# Altium schematic sheet p1_led_adapter.SchDoc
size A
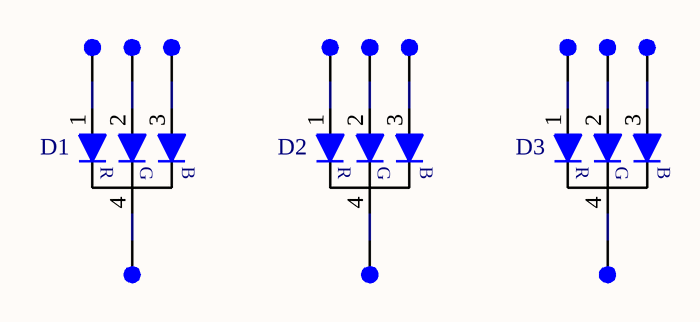
[diagram p0: p1_led_adapter.SchDoc]

## Parts
D1  XZM2CRKM2DGFBB45SCCB  [SUN_PLCC4]  (value not drawn)
D2  XZM2CRKM2DGFBB45SCCB  [SUN_PLCC4]  (value not drawn)
D3  XZM2CRKM2DGFBB45SCCB  [SUN_PLCC4]  (value not drawn)
TP1  PTH Test Point  [TP_PTH]  (value not drawn)
TP2  PTH Test Point  [TP_PTH]  (value not drawn)
TP3  PTH Test Point  [TP_PTH]  (value not drawn)
TP4  PTH Test Point  [TP_PTH]  (value not drawn)
TP5  PTH Test Point  [TP_PTH]  (value not drawn)
TP6  PTH Test Point  [TP_PTH]  (value not drawn)
TP7  PTH Test Point  [TP_PTH]  (value not drawn)
TP8  PTH Test Point  [TP_PTH]  (value not drawn)
TP9  PTH Test Point  [TP_PTH]  (value not drawn)
TP10  PTH Test Point  [TP_PTH]  (value not drawn)
TP11  PTH Test Point  [TP_PTH]  (value not drawn)
TP12  PTH Test Point  [TP_PTH]  (value not drawn)

## Nets
NetD1_1: D1.1(A1) TP1.1
NetD1_2: D1.2(A2) TP2.1
NetD1_3: D1.3(A3) TP3.1
NetD1_4: D1.4(K) TP10.1
NetD2_1: D2.1(A1) TP4.1
NetD2_2: D2.2(A2) TP5.1
NetD2_3: D2.3(A3) TP6.1
NetD2_4: D2.4(K) TP11.1
NetD3_1: D3.1(A1) TP7.1
NetD3_2: D3.2(A2) TP8.1
NetD3_3: D3.3(A3) TP9.1
NetD3_4: D3.4(K) TP12.1

## Notes on the sheet
- (in symbol RGB LED) R; G; B

## Library data of the parts
D1-D3 = RGB LED: LED RGB CLEAR 4PLCC SMD; Manufacturer: SunLED; Color: Red, Green, Blue (RGB); Lens Color: Colorless; Millicandela Rating: 497mcd Red, 1590mcd Green, 327mcd Blue; Lens Style/Size: Round with Flat Top, 2.40mm; Voltage - Forward (Vf) (Typ): 2.2V Red, 3.2V Green, 3.3V Blue; Current - Test: 20mA Red, 20mA Green, 20mA Blue; Viewing Angle: 120°; Wavelength - Dominant: 625nm Red, 525nm Green, 470nm Blue; Wavelength - Peak: 640nm Red, 520nm Green, 465nm Blue; Published: 8-Jun-2000; LatestRevisionDate: 17-Jul-2002; LatestRevisionNote: Re-released for DXP Platform.; PackageVersion: Feb-2002; PackageReference: 3.2X1.6X1.1; Publisher: Altium Limited; PackageDescription: SM LED; 2 Flat Leads; Supplier 1: Digikey; Manufacturer Part Number: XZM2CRKM2DGFBB45SCCB; Stock 1: 1257; Pricing 1: 1=1.17, 10=0.947, 25=0.7288, 100=0.6559, 250=0.583, 500=0.4956, 1000=0.4081 (USD); Category: Optoelectronics; Family: LED Indication - Discrete; Series: -; Packaging: Tape &amp; Reel (TR); Lens Transparency: Clear; Mounting Type: Surface Mount; Features: -; Package / Case: 4-PLCC; Supplier Device Package: 4-PLCC; Size / Dimension: 3.20mm L x 2.80mm W; Height (Max): 2.10mm; Supplier Part Number 1: 1497-1225-1-ND
TP1-TP12 = PTH Test Point: Test Point